# EAGLE schematic expansion-board (EAGLE 6.5.0)
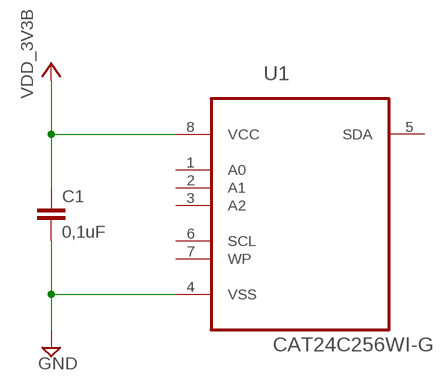
[diagram p0: schematic, sheet 1]

## Parts
C1  0,1uF  C2,5-3  [C2.5-3]
U1  CAT24C256WI-G  [SOIC127P600X175-8N]

## Nets
+3V3: C1.1 U1.8(VCC) ; supply symbol labelled VDD_3V3B
GND: C1.2 U1.4(VSS)
Unconnected: U1.1(A0) U1.2(A1) U1.3(A2) U1.5(SDA) U1.6(SCL) U1.7(WP)

## Library data of the parts
C1 = capacitor-wima:C: CAPACITOR naming: grid - package width
U1 = components:CAT24C256WI-G: 256-Kb I2C CMOS Serial EEPROM; MF: ON SEMICONDUCTOR; MPN: CAT24C256WI-G; OC_FARNELL: 1631142; OC_NEWARK: 06R0552; PACKAGE: SOIC-8; SUPPLIER: CATALYST SEMICONDUCTOR